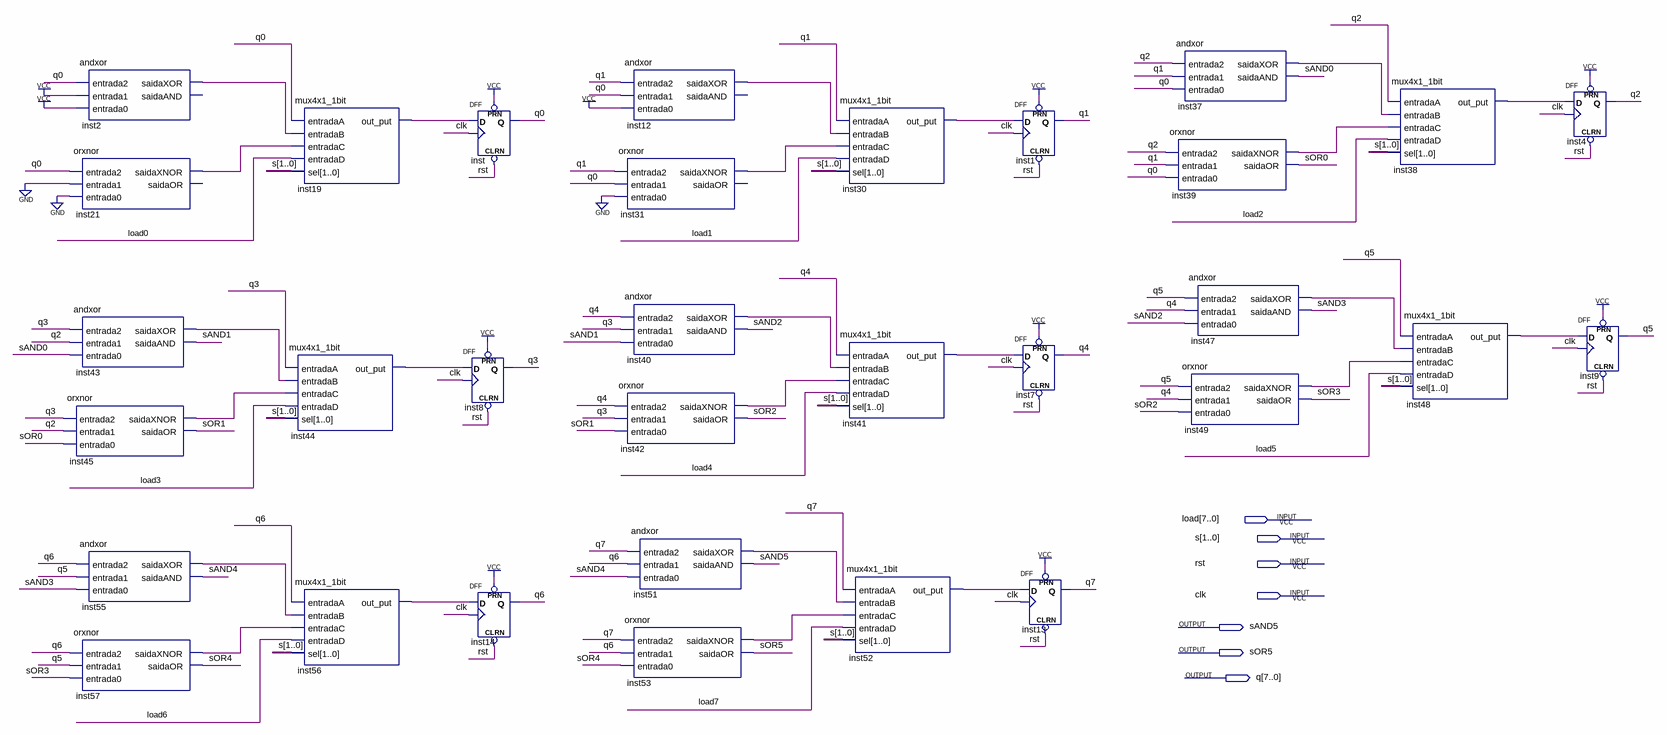
[diagram p0: schematic sheet]
// Quartus schematic pc.bdf as structural Verilog: 32 symbols, 7 pins
module pc (
  input  [7:0] load,
  input  [1:0] s,
  input  rst,
  input  clk,
  output sAND5,
  output sOR5,
  output [7:0] q
);

  wire inst2_saidaxor, inst12_saidaxor, inst19_out_put, inst21_saidaxnor, inst30_out_put, inst31_saidaxnor,
       inst37_saidaxor, inst38_out_put, inst39_saidaxnor, inst40_saidaxor, inst41_out_put, inst42_saidaxnor,
       inst43_saidaxor, inst44_out_put, inst45_saidaxnor, inst47_saidaxor, inst48_out_put, inst49_saidaxnor,
       inst51_saidaxor, inst52_out_put, inst53_saidaxnor, inst55_saidaxor, inst56_out_put, inst57_saidaxnor,
       sAND0, sAND1, sAND2, sAND3, sAND4, sOR0, sOR1, sOR2, sOR3, sOR4;

  andxor inst2 (.entrada2(q[0]), .entrada1(1'b1), .entrada0(1'b1), .saidaXOR(inst2_saidaxor));  // open: saidaAND
  orxnor inst21 (.entrada2(q[0]), .entrada1(1'b0), .entrada0(1'b0), .saidaXNOR(inst21_saidaxnor));  // open: saidaOR
  andxor inst43 (.entrada2(q[3]), .entrada1(q[2]), .entrada0(sAND0), .saidaXOR(inst43_saidaxor), .saidaAND(sAND1));
  orxnor inst45 (.entrada2(q[3]), .entrada1(q[2]), .entrada0(sOR0), .saidaXNOR(inst45_saidaxnor), .saidaOR(sOR1));
  andxor inst55 (.entrada2(q[6]), .entrada1(q[5]), .entrada0(sAND3), .saidaXOR(inst55_saidaxor), .saidaAND(sAND4));
  orxnor inst57 (.entrada2(q[6]), .entrada1(q[5]), .entrada0(sOR3), .saidaXNOR(inst57_saidaxnor), .saidaOR(sOR4));
  mux4x1_1bit inst19 (
    .entradaA(q[0]), .entradaB(inst2_saidaxor), .entradaC(inst21_saidaxnor), .entradaD(load[0]), .sel(s),
    .out_put(inst19_out_put));
  mux4x1_1bit inst44 (
    .entradaA(q[3]), .entradaB(inst43_saidaxor), .entradaC(inst45_saidaxnor), .entradaD(load[3]), .sel(s),
    .out_put(inst44_out_put));
  mux4x1_1bit inst56 (
    .entradaA(q[6]), .entradaB(inst55_saidaxor), .entradaC(inst57_saidaxnor), .entradaD(load[6]), .sel(s),
    .out_put(inst56_out_put));
  DFF inst (.CLRN(rst), .CLK(clk), .D(inst19_out_put), .PRN(1'b1), .Q(q[0]));
  DFF inst8 (.CLRN(rst), .CLK(clk), .D(inst44_out_put), .PRN(1'b1), .Q(q[3]));
  DFF inst14 (.CLRN(rst), .CLK(clk), .D(inst56_out_put), .PRN(1'b1), .Q(q[6]));
  andxor inst12 (.entrada2(q[1]), .entrada1(q[0]), .entrada0(1'b1), .saidaXOR(inst12_saidaxor));  // open: saidaAND
  orxnor inst31 (.entrada2(q[1]), .entrada1(q[0]), .entrada0(1'b0), .saidaXNOR(inst31_saidaxnor));  // open: saidaOR
  andxor inst40 (.entrada2(q[4]), .entrada1(q[3]), .entrada0(sAND1), .saidaXOR(inst40_saidaxor), .saidaAND(sAND2));
  orxnor inst42 (.entrada2(q[4]), .entrada1(q[3]), .entrada0(sOR1), .saidaXNOR(inst42_saidaxnor), .saidaOR(sOR2));
  andxor inst51 (.entrada2(q[7]), .entrada1(q[6]), .entrada0(sAND4), .saidaXOR(inst51_saidaxor), .saidaAND(sAND5));
  orxnor inst53 (.entrada2(q[7]), .entrada1(q[6]), .entrada0(sOR4), .saidaXNOR(inst53_saidaxnor), .saidaOR(sOR5));
  mux4x1_1bit inst30 (
    .entradaA(q[1]), .entradaB(inst12_saidaxor), .entradaC(inst31_saidaxnor), .entradaD(load[1]), .sel(s),
    .out_put(inst30_out_put));
  mux4x1_1bit inst41 (
    .entradaA(q[4]), .entradaB(inst40_saidaxor), .entradaC(inst42_saidaxnor), .entradaD(load[4]), .sel(s),
    .out_put(inst41_out_put));
  mux4x1_1bit inst52 (
    .entradaA(q[7]), .entradaB(inst51_saidaxor), .entradaC(inst53_saidaxnor), .entradaD(load[7]), .sel(s),
    .out_put(inst52_out_put));
  DFF inst1 (.CLRN(rst), .CLK(clk), .D(inst30_out_put), .PRN(1'b1), .Q(q[1]));
  DFF inst7 (.CLRN(rst), .CLK(clk), .D(inst41_out_put), .PRN(1'b1), .Q(q[4]));
  DFF inst13 (.CLRN(rst), .CLK(clk), .D(inst52_out_put), .PRN(1'b1), .Q(q[7]));
  orxnor inst39 (.entrada2(q[2]), .entrada1(q[1]), .entrada0(q[0]), .saidaXNOR(inst39_saidaxnor), .saidaOR(sOR0));
  andxor inst37 (.entrada2(q[2]), .entrada1(q[1]), .entrada0(q[0]), .saidaXOR(inst37_saidaxor), .saidaAND(sAND0));
  andxor inst47 (.entrada2(q[5]), .entrada1(q[4]), .entrada0(sAND2), .saidaXOR(inst47_saidaxor), .saidaAND(sAND3));
  orxnor inst49 (.entrada2(q[5]), .entrada1(q[4]), .entrada0(sOR2), .saidaXNOR(inst49_saidaxnor), .saidaOR(sOR3));
  mux4x1_1bit inst38 (
    .entradaA(q[2]), .entradaB(inst37_saidaxor), .entradaC(inst39_saidaxnor), .entradaD(load[2]), .sel(s),
    .out_put(inst38_out_put));
  mux4x1_1bit inst48 (
    .entradaA(q[5]), .entradaB(inst47_saidaxor), .entradaC(inst49_saidaxnor), .entradaD(load[5]), .sel(s),
    .out_put(inst48_out_put));
  DFF inst4 (.CLRN(rst), .CLK(clk), .D(inst38_out_put), .PRN(1'b1), .Q(q[2]));
  DFF inst9 (.CLRN(rst), .CLK(clk), .D(inst48_out_put), .PRN(1'b1), .Q(q[5]));
endmodule
